# Altium schematic sheet Modules.SchDoc
size A4
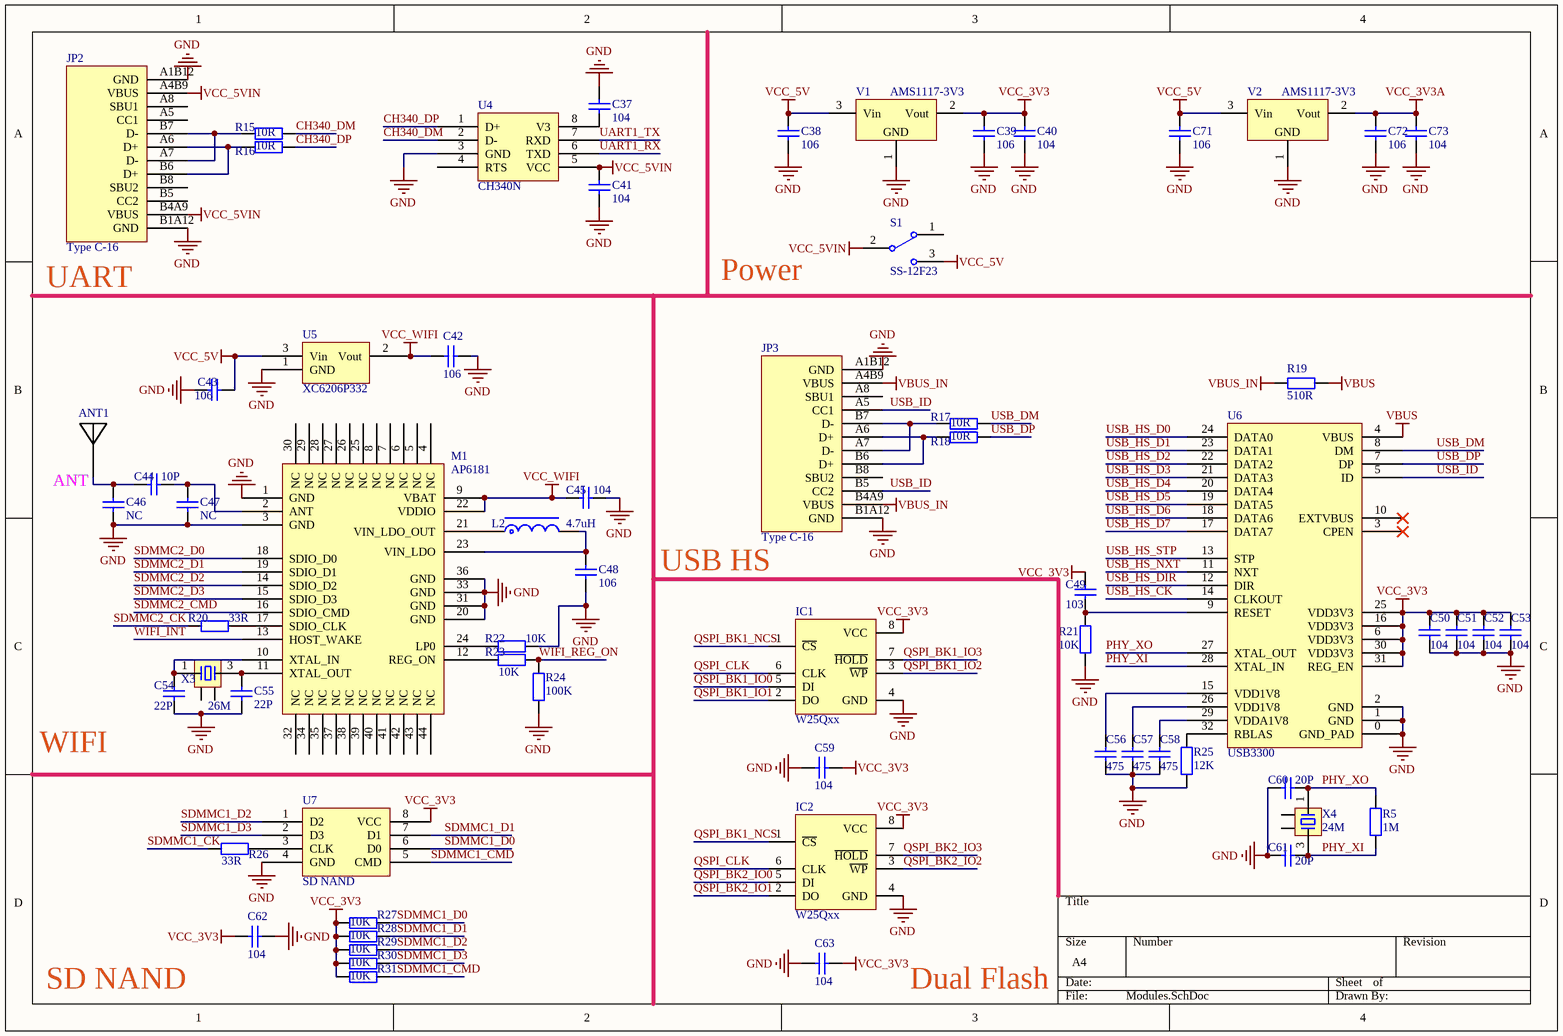
[diagram p0: Modules.SchDoc]

## Parts
ANT1  ANT_SMD  [2.4G ANT]  (value not drawn)
C37  104  [C0402_M]
C38  106  [C1206_M]
C39  106  [C0402_M]
C40  104  [C0402_M]
C41  104  [C0402_M]
C42  106  [C0402_M]
C43  106  [C0402_M]
C44  10P  [C0402_M]
C45  104  [C0402_M]
C46  NC  [C0402_M]
C47  NC  [C0402_M]
C48  106  [C0402_M]
C49  103  [C0402_M]
C50  104  [C0402_M]
C51  104  [C0402_M]
C52  104  [C0402_M]
C53  104  [C0402_M]
C54  22P  [C0402_M]
C55  22P  [C0402_M]
C56  475  [C0402_M]
C57  475  [C0402_M]
C58  475  [C0402_M]
C59  104  [C0402_M]
C60  20P  [C0402_M]
C61  20P  [C0402_M]
C62  104  [C0402_M]
C63  104  [C0402_M]
C71  106  [C1206_M]
C72  106  [C0402_M]
C73  104  [C0402_M]
IC1  W25Qxx  [SOP8W_N]
IC2  W25Qxx  [SOP8W_N]
JP2  Type C-16  [TypeC16]
JP3  Type C-16  [TypeC16]
L2  4.7uH  [L1210]
M1  AP6181  [AP6181]
R5  1M  [R0402_M]
R15  10R  [R0402_M]
R16  10R  [R0402_M]
R17  10R  [R0402_M]
R18  10R  [R0402_M]
R19  510R  [R0603_M]
R20  33R  [R0402_M]
R21  10K  [R0402_M]
R22  10K  [R0402_M]
R23  10K  [R0402_M]
R24  100K  [R0402_M]
R25  12K  [R0402_M]
R26  33R  [R0402_M]
R27  10K  [R0402_M]
R28  10K  [R0402_M]
R29  10K  [R0402_M]
R30  10K  [R0402_M]
R31  10K  [R0402_M]
S1  SS-12F23  [MSK-12C01-07]
U4  CH340N  [SOP8]
U5  XC6206P332  [SOT23-3N]
U6  USB3300  [QFN32 5x5_M]
U7  SD NAND  [LGA8 6x8mm]
V1  AMS1117-3V3  [SOT89_N]
V2  AMS1117-3V3  [SOT89_N]
X3  26M  [XTAL-3225-4P]
X4  24M  [XTAL-3225-4P]

## Nets
GND: C37.2 C38.1 C39.1 C40.1 C41.1 C42.1 C43.2 C45.1 C46.2 C47.2 C48.1 C50.1 C51.1 C52.1 C53.1 C54.1 C55.1 C56.1 C57.1 C58.1 C59.1 C60.1 C61.1 C62.1 C63.1 C71.1 C72.1 C73.1 IC1.4(GND) IC2.4(GND) JP2.A1B12(GND) JP2.B1A12(GND) JP3.A1B12(GND) JP3.B1A12(GND) M1.1(GND) M1.3(GND) M1.20(GND) M1.31(GND) M1.33(GND) M1.36(GND) R21.1 R22.1 R24.2 R25.2 U4.3(GND) U5.1(GND) U6.0(GND_PAD) U6.1(GND) U6.2(GND) U7.4(GND) V1.1(GND) V2.1(GND)
VBUS: R19.1 U6.4(VBUS)
VBUS_IN: JP3.A4B9(VBUS) JP3.B4A9(VBUS) R19.2
VCC_3V3: C39.2 C40.2 C49.2 C50.2 C51.2 C52.2 C53.2 C59.2 C62.2 C63.2 IC1.8(VCC) IC2.8(VCC) R27.2 R28.2 R29.2 R30.2 R31.2 U6.6(VDD3V3) U6.16(VDD3V3) U6.25(VDD3V3) U6.30(VDD3V3) U6.31(REG_EN) U7.8(VCC) V1.2(Vout)
VCC_3V3A: C72.2 C73.2 V2.2(Vout)
VCC_5V: C38.2 C43.1 C71.2 S1.3 U5.3(Vin) V1.3(Vin) V2.3(Vin)
VCC_5VIN: C41.2 JP2.A4B9(VBUS) JP2.B4A9(VBUS) S1.2 U4.5(VCC)
VCC_WIFI: C42.2 C45.2 M1.9(VBAT) M1.22(VDDIO) U5.2(Vout)
CH340_DM: R15.1 U4.2(D-)
CH340_DP: R16.1 U4.1(D+)
PHY_XI: C61.2 R5.1 U6.28(XTAL_IN) X4.3
PHY_XO: C60.2 R5.2 U6.27(XTAL_OUT) X4.1
QSPI_BK1_IO0: IC1.5(DI)
QSPI_BK1_IO1: IC1.2(DO)
QSPI_BK1_IO2: IC1.3(~{WP})
QSPI_BK1_IO3: IC1.7(~{HOLD})
QSPI_BK1_NCS: IC1.1(~{CS}) IC2.1(~{CS})
QSPI_BK2_IO0: IC2.5(DI)
QSPI_BK2_IO1: IC2.2(DO)
QSPI_BK2_IO2: IC2.3(~{WP})
QSPI_BK2_IO3: IC2.7(~{HOLD})
QSPI_CLK: IC1.6(CLK) IC2.6(CLK)
SDMMC1_CK: R26.2
SDMMC1_CMD: R31.1 U7.5(CMD)
SDMMC1_D0: R27.1 U7.6(D0)
SDMMC1_D1: R28.1 U7.7(D1)
SDMMC1_D2: R29.1 U7.1(D2)
SDMMC1_D3: R30.1 U7.2(D3)
SDMMC2_CK: R20.2
SDMMC2_CMD: M1.16(SDIO_CMD)
SDMMC2_D0: M1.18(SDIO_D0)
SDMMC2_D1: M1.19(SDIO_D1)
SDMMC2_D2: M1.14(SDIO_D2)
SDMMC2_D3: M1.15(SDIO_D3)
UART1_RX: U4.6(TXD)
UART1_TX: U4.7(RXD)
USB_DM: R17.1 U6.8(DM)
USB_DP: R18.1 U6.7(DP)
USB_HS_CK: U6.14(CLKOUT)
USB_HS_D0: U6.24(DATA0)
USB_HS_D1: U6.23(DATA1)
USB_HS_D2: U6.22(DATA2)
USB_HS_D3: U6.21(DATA3)
USB_HS_D4: U6.20(DATA4)
USB_HS_D5: U6.19(DATA5)
USB_HS_D6: U6.18(DATA6)
USB_HS_D7: U6.17(DATA7)
USB_HS_DIR: U6.12(DIR)
USB_HS_NXT: U6.11(NXT)
USB_HS_STP: U6.13(STP)
USB_ID: JP3.A5(CC1) JP3.B5(CC2) U6.5(ID)
WIFI_INT: M1.13(HOST_WAKE)
WIFI_REG_ON: R23.1 R24.1
NetANT1_1: ANT1.1 C44.2 C46.1
NetC37_1: C37.1 U4.8(V3)
NetC44_1: C44.1 C47.1 M1.2(ANT)
NetC48_2: C48.2 L2.2 M1.23(VIN_LDO)
NetC49_1: C49.1 R21.2 U6.9(RESET)
NetC54_2: C54.2 M1.10(XTAL_IN) X3.1
NetC55_2: C55.2 M1.11(XTAL_OUT) X3.3
NetC56_2: C56.2 U6.15(VDD1V8)
NetC57_2: C57.2 U6.26(VDD1V8)
NetC58_2: C58.2 U6.29(VDDA1V8)
NetJP2_A6: JP2.A6(D+) JP2.B6(D+) R16.2
NetJP2_A7: JP2.A7(D-) JP2.B7(D-) R15.2
NetJP3_A6: JP3.A6(D+) JP3.B6(D+) R18.2
NetJP3_A7: JP3.A7(D-) JP3.B7(D-) R17.2
NetL2_1: L2.1 M1.21(VIN_LDO_OUT)
NetM1_12: M1.12(REG_ON) R23.2
NetM1_17: M1.17(SDIO_CLK) R20.1
NetM1_24: M1.24(LP0) R22.2
NetR25_1: R25.1 U6.32(RBLAS)
NetR26_1: R26.1 U7.3(CLK)

Not connected (* = marked no-connect by the designer): JP2 A5(CC1) A8(SBU1) B5(CC2) B8(SBU2); JP3 A8(SBU1) B8(SBU2); M1 4(NC) 5(NC) 6(NC) 7(NC) 8(NC) 25(NC) 26(NC) 27(NC) 28(NC) 29(NC) 30(NC) 32(NC) 34(NC) 35(NC) 37(NC) 38(NC) 39(NC) 40(NC) 41(NC) 42(NC) 43(NC) 44(NC); S1 1; U4 4(RTS); U6 3(CPEN)* 10(EXTVBUS)*; X3 2 4; X4 2 4

## Notes on the sheet
- (near JP2) UART
- Power
- ANT
- USB HS
- WIFI
- SD NAND
- Dual Flash

## Library data of the parts
C37-C63 C71-C73 = C: 贴片电容/MLCC电容; BOM名称: 无极性贴片电容; 联系卖家，免费查找封装: 唯一出售店铺网址https://shop463601444.taobao.com
IC1 IC2 = W25Q: SPI Flash; BOM名称: 外置Flash; 版权归属: 封装库来自淘宝 ID：黄晶宝石; 学习资源: https://shop463601444.taobao.com
L2 = L-NR: 太诱-NR磁胶电感; BOM名称: NR磁胶电感; 联系卖家，免费查找封装: 唯一出售店铺网址https://shop463601444.taobao.com
M1 = AP6181: SDIO WIFI模块
R5 R15-R31 = R: 贴片电阻; 联系卖家，免费查找封装: 唯一出售店铺网址https://shop463601444.taobao.com; BOM名称: 贴片电阻
S1 = SSW-1P: 1路波动开关; BOM名称: 波动开关; 联系卖家，免费查找封装: 唯一出售店铺网址https://shop463601444.taobao.com; 封装库来自淘宝卖家ID：黄晶宝石: 其他店铺购入的，请立即申请退款，本店现金奖励20~500元
U4 = CH340N: USB转UART芯片 8P
U5 = XC6206P332: 低压差LDO
U6 = USB3300: USB2.0 HS PHY; pin to pad: 0>33
U7 = SD NAND: 贴片式SD
V1 V2 = AMS1117_SOT89: 三端稳压芯片; BOM名称: 稳压芯片; 封装库来自淘宝卖家ID：黄晶宝石: 其他店铺购入的买家，请立即申请退款，本店现金奖励20~1000元
X3 X4 = XTAL-4P: 4脚无源晶振(谐振器）; 联系卖家，免费查找封装: 唯一出售店铺网址https://shop463601444.taobao.com; BOM名称: 4脚无源晶振(谐振器）